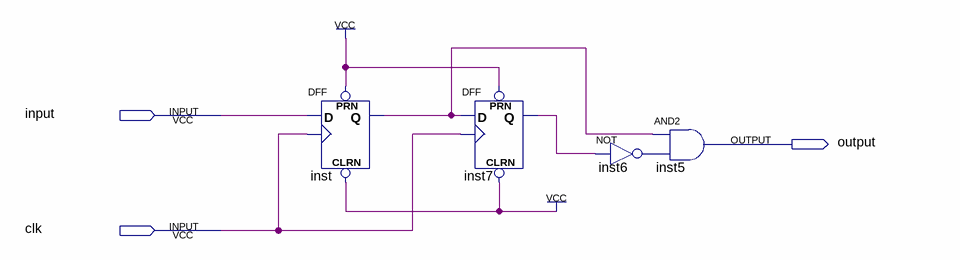
[diagram p0: schematic sheet]
// Quartus schematic rising_edge_detector.bdf as structural Verilog: 4 symbols, 3 pins
module rising_edge_detector (
  input  \input ,
  input  clk,
  output \output 
);

  wire inst6_out, inst7_q, inst_q;

  DFF inst (.CLRN(1'b1), .CLK(clk), .D(\input ), .PRN(1'b1), .Q(inst_q));
  DFF inst7 (.CLRN(1'b1), .CLK(clk), .D(inst_q), .PRN(1'b1), .Q(inst7_q));
  not inst6 (inst6_out, inst7_q);
  and inst5 (\output , inst_q, inst6_out);
endmodule
